# EAGLE design OV5640 (EAGLE 9.4.2)
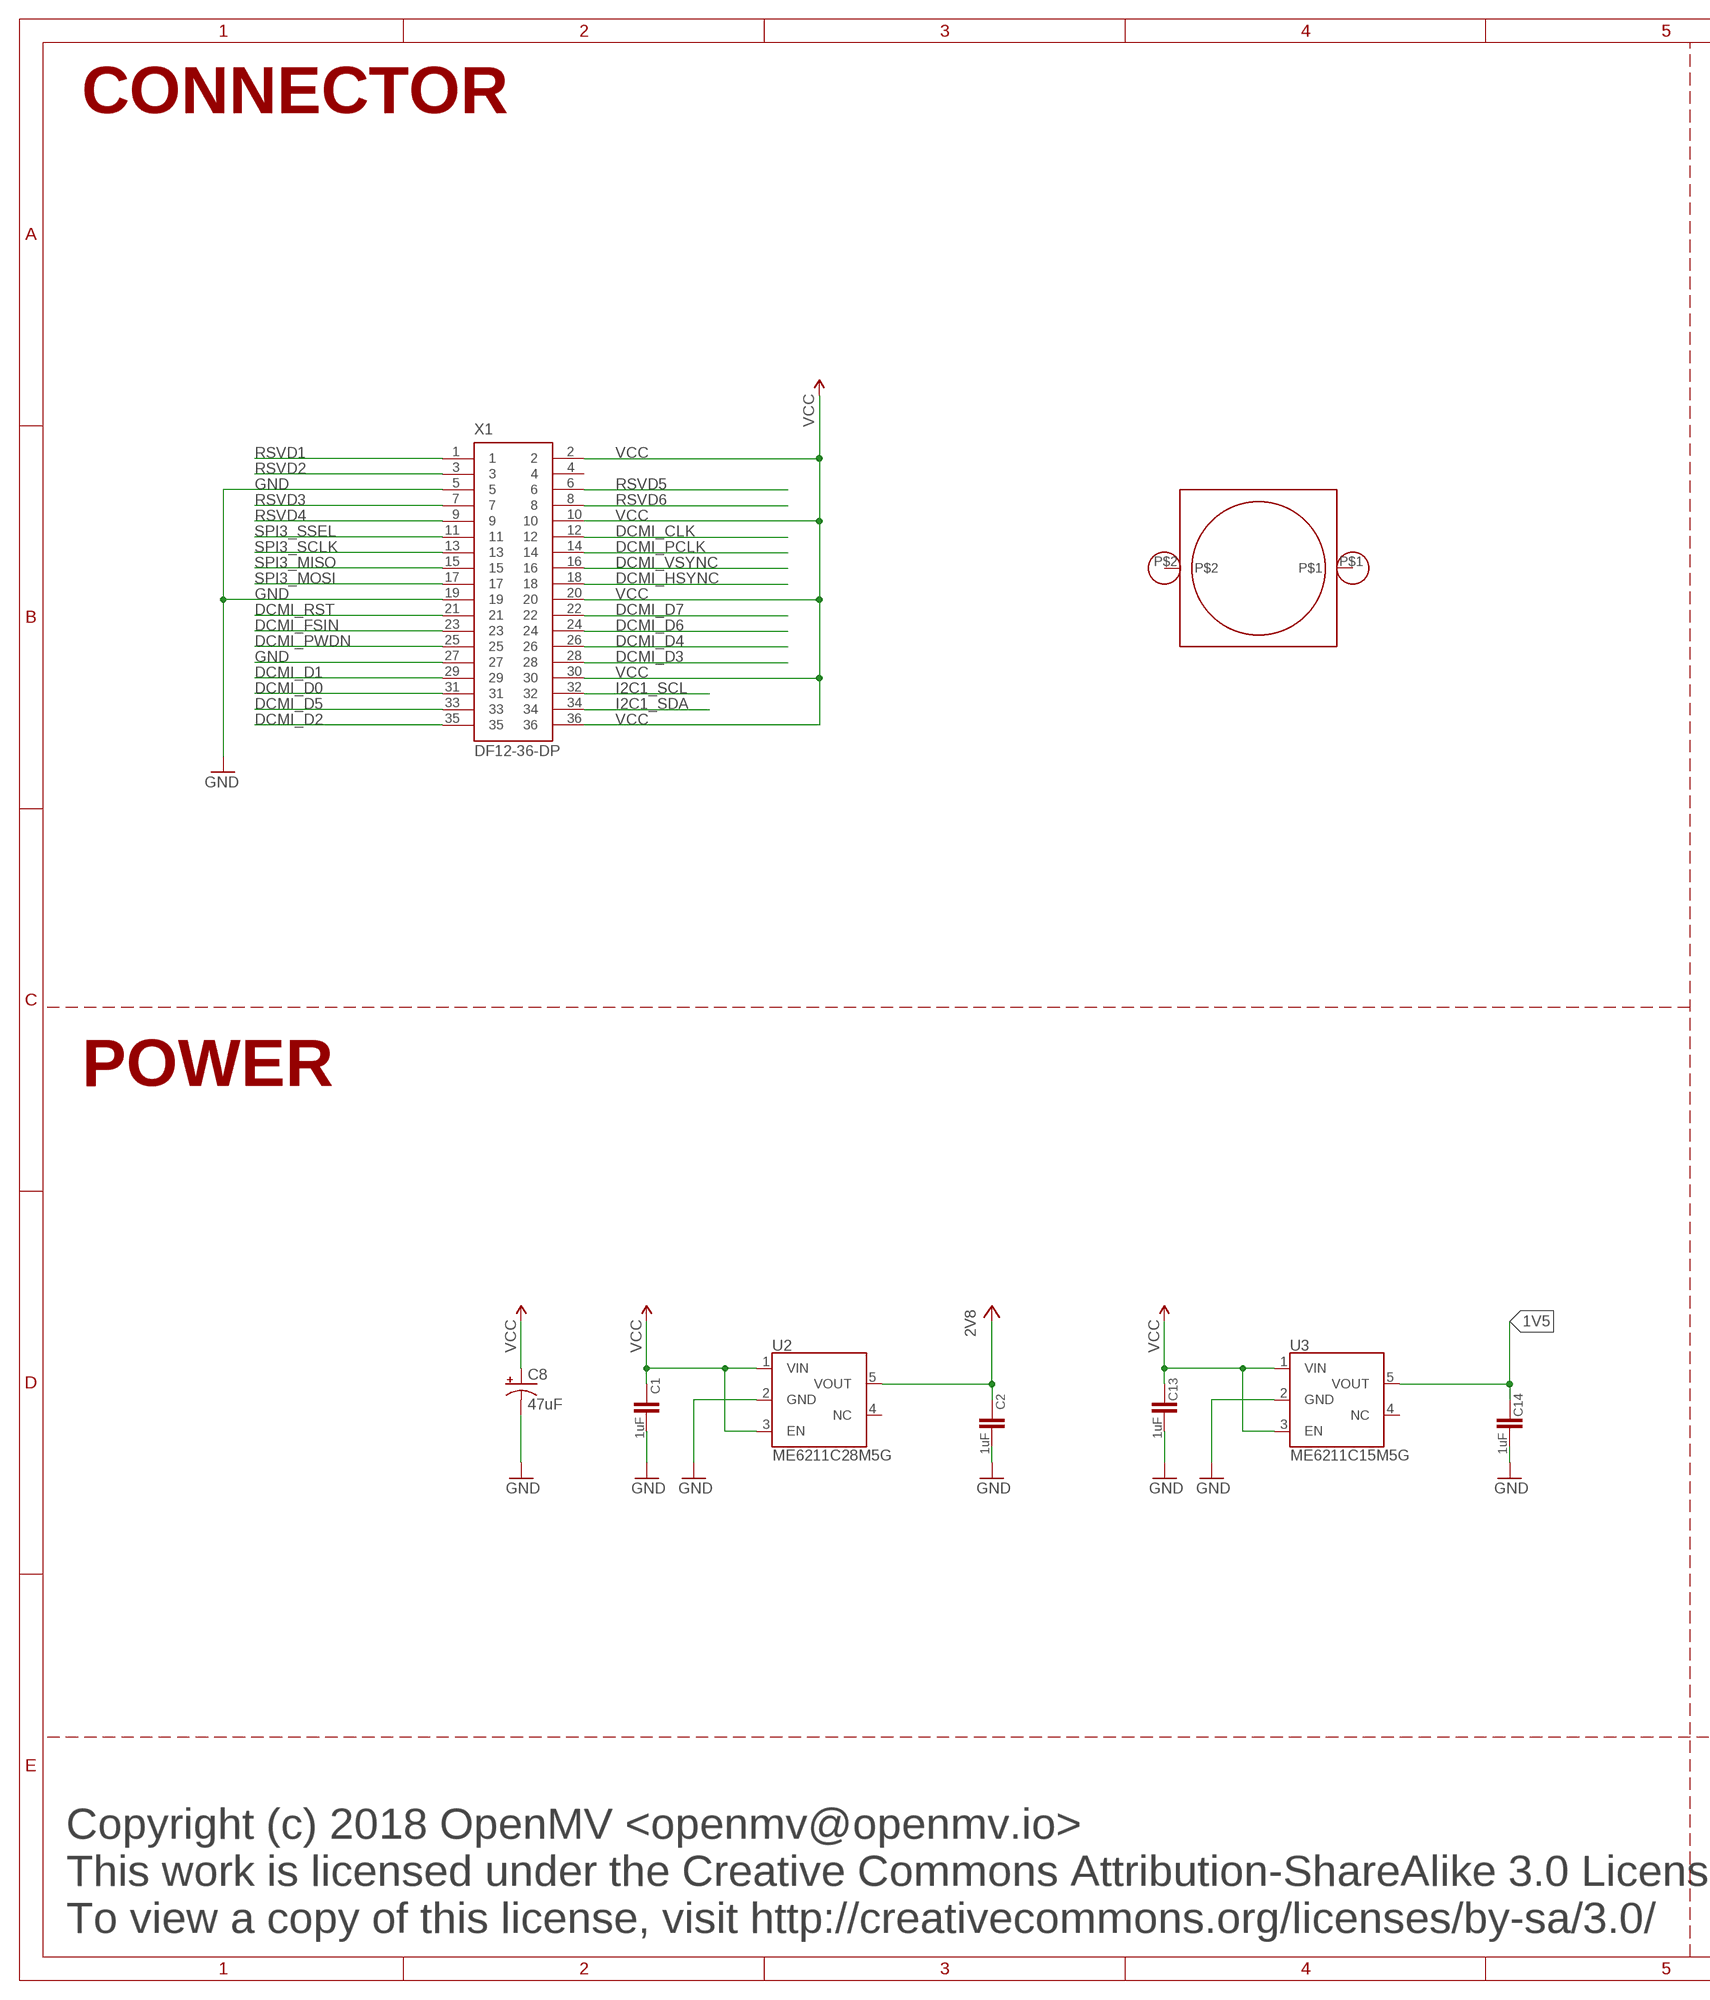
[diagram p0: schematic, sheet 1, part 1 of 2]
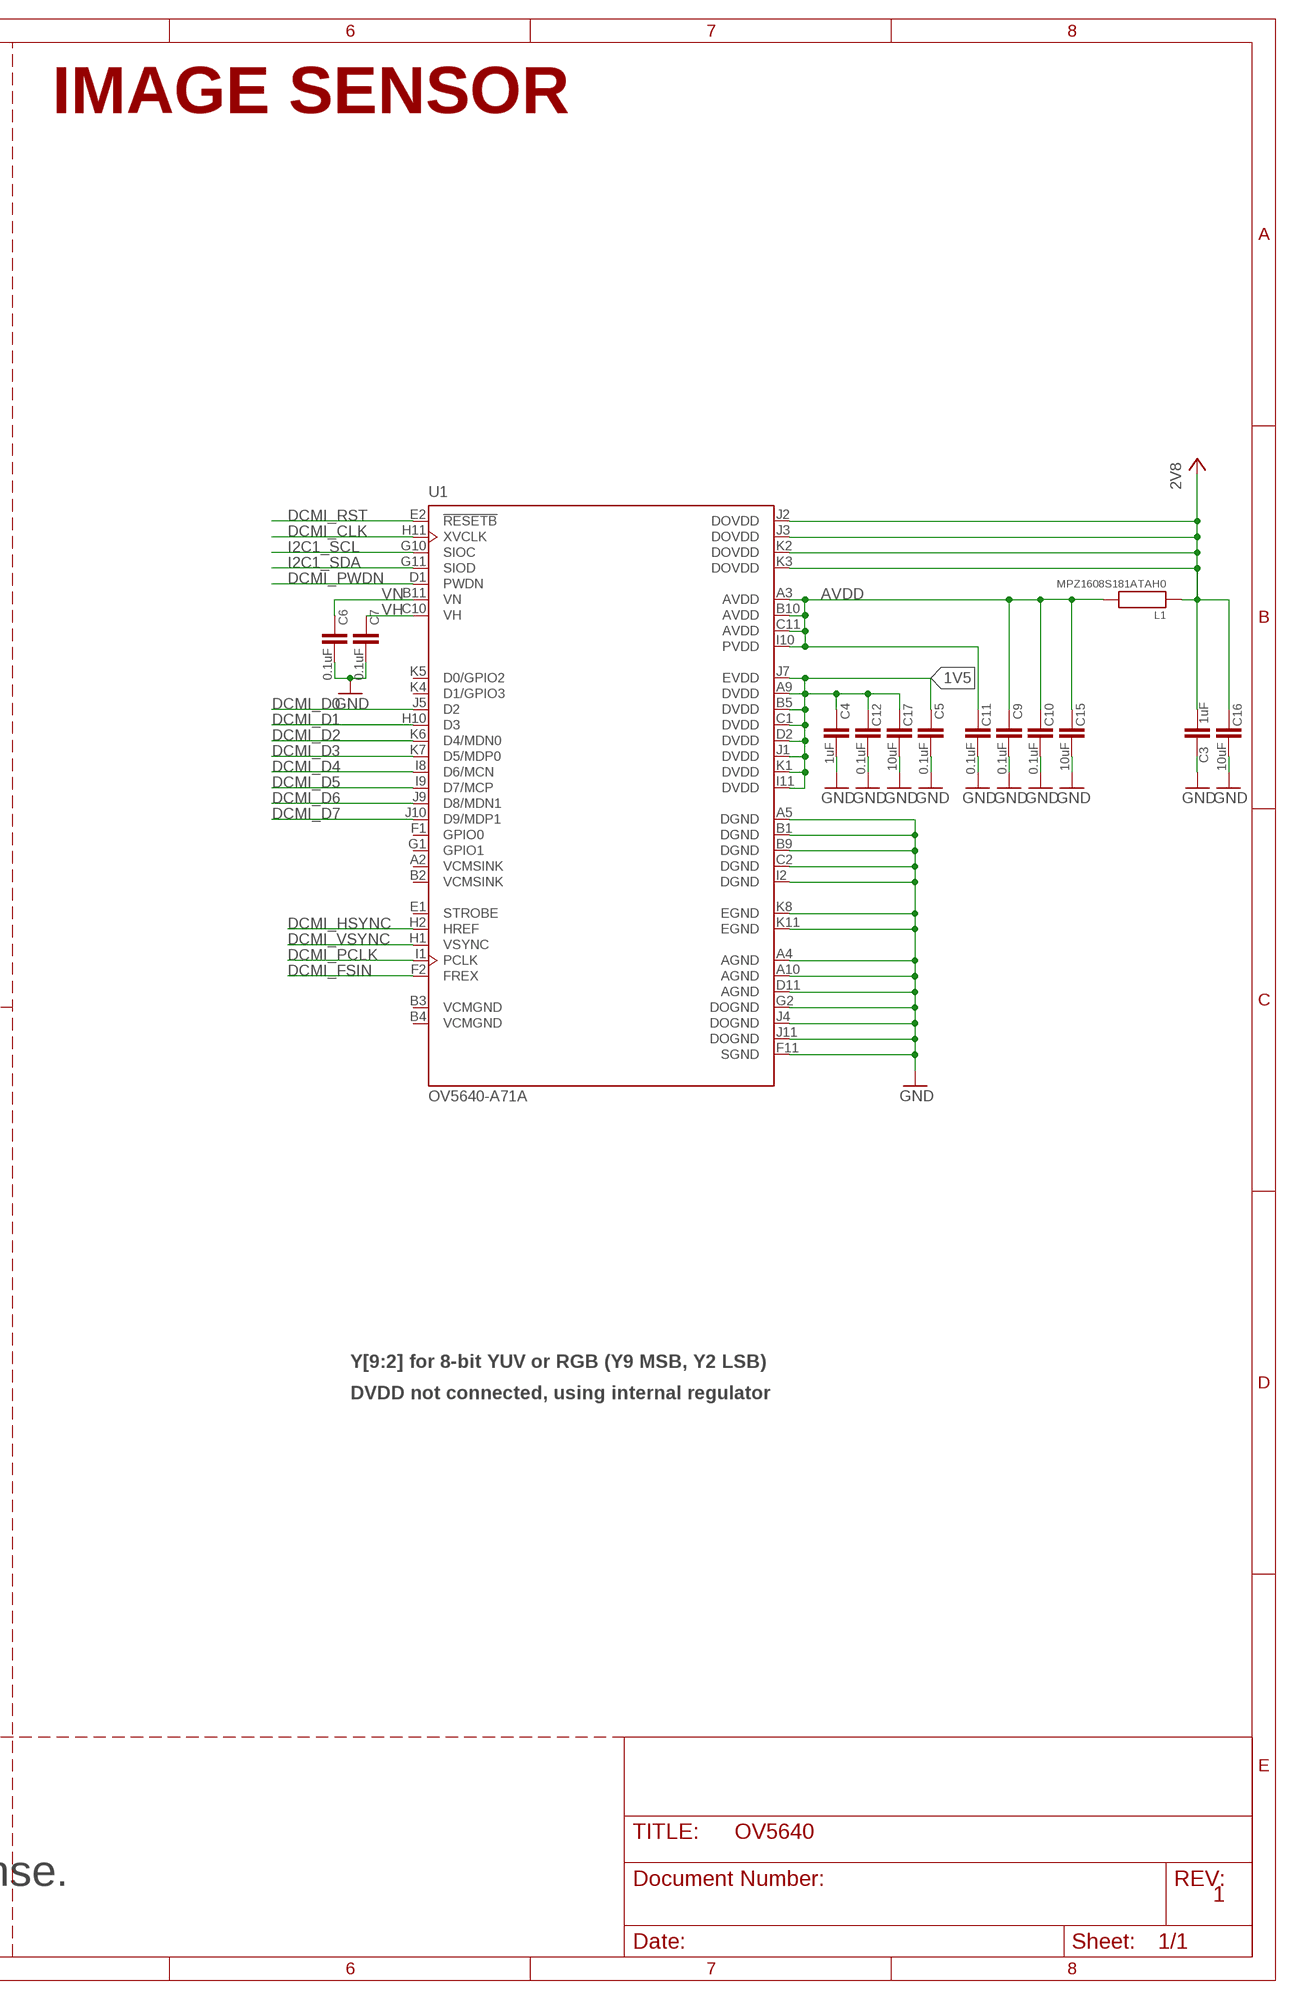
[diagram p1: schematic, sheet 1, part 2 of 2]

## Parts
C1  1uF  CAP0402-CAP  [0402-CAP]
C2  1uF  CAP0402-CAP  [0402-CAP]
C3  1uF  CAP0402-CAP  [0402-CAP]
C4  1uF  CAP0402-CAP  [0402-CAP]
C5  0.1uF  CAP0402-CAP  [0402-CAP]
C6  0.1uF  CAP0402-CAP  [0402-CAP]
C7  0.1uF  CAP0402-CAP  [0402-CAP]
C8  47uF  CAP_POL1206  [EIA3216]
C9  0.1uF  CAP0402-CAP  [0402-CAP]
C10  0.1uF  CAP0402-CAP  [0402-CAP]
C11  0.1uF  CAP0402-CAP  [0402-CAP]
C12  0.1uF  CAP0402-CAP  [0402-CAP]
C13  1uF  CAP0402-CAP  [0402-CAP]
C14  1uF  CAP0402-CAP  [0402-CAP]
C15  10uF  CAP0402-CAP  [0402-CAP]
C16  10uF  CAP0402-CAP  [0402-CAP]
C17  10uF  CAP0402-CAP  [0402-CAP]
L1  MPZ1608S181ATAH0  BEAD  [0402-CAP]
LM1  LENSMOUNT20MM  [LENSMOUNT-20MM]
U1  OV5640-A71A  [BGA71C50P11X11_598X584X81]
U2  ME6211C28M5G  ADP150TSOT-5  [SOT23-5]
U3  ME6211C15M5G  ADP150TSOT-5  [SOT23-5]
X1  DF12-36-DP  [DF12-36-DP]

## Nets
1V5: C4.2 C5.2 C12.2 C14.2 C17.2 U1.A9(DVDD) U1.B5(DVDD) U1.C1(DVDD) U1.D2(DVDD) U1.I11(DVDD) U1.J1(DVDD) U1.J7(EVDD) U1.K1(DVDD) U3.5(VOUT)
2V8: C2.2 C3.1 C16.2 L1.1 U1.J2(DOVDD) U1.J3(DOVDD) U1.K2(DOVDD) U1.K3(DOVDD) U2.5(VOUT)
AVDD: C9.2 C10.2 C11.2 C15.2 L1.2 U1.A3(AVDD) U1.B10(AVDD) U1.C11(AVDD) U1.I10(PVDD)
DCMI_CLK: U1.H11(XVCLK) X1.12
DCMI_D0: U1.J5(D2) X1.31
DCMI_D1: U1.H10(D3) X1.29
DCMI_D2: U1.K6(D4/MDN0) X1.35
DCMI_D3: U1.K7(D5/MDP0) X1.28
DCMI_D4: U1.I8(D6/MCN) X1.26
DCMI_D5: U1.I9(D7/MCP) X1.33
DCMI_D6: U1.J9(D8/MDN1) X1.24
DCMI_D7: U1.J10(D9/MDP1) X1.22
DCMI_FSIN: U1.F2(FREX) X1.23
DCMI_HSYNC: U1.H2(HREF) X1.18
DCMI_PCLK: U1.I1(PCLK) X1.14
DCMI_PWDN: U1.D1(PWDN) X1.25
DCMI_RST: U1.E2(!RESETB) X1.21
DCMI_VSYNC: U1.H1(VSYNC) X1.16
GND: C1.1 C2.1 C3.2 C4.1 C5.1 C6.1 C7.1 C8.C(-) C9.1 C10.1 C11.1 C12.1 C13.1 C14.1 C15.1 C16.1 C17.1 U1.A4(AGND) U1.A5(DGND) U1.A10(AGND) U1.B1(DGND) U1.B9(DGND) U1.C2(DGND) U1.D11(AGND) U1.F11(SGND) U1.G2(DOGND) U1.I2(DGND) U1.J4(DOGND) U1.J11(DOGND) U1.K8(EGND) U1.K11(EGND) U2.2(GND) U3.2(GND) X1.5 X1.19 X1.27
I2C1_SCL: U1.G10(SIOC) X1.32
I2C1_SDA: U1.G11(SIOD) X1.34
RSVD1: X1.1
RSVD2: X1.3
RSVD3: X1.7
RSVD4: X1.9
RSVD5: X1.6
RSVD6: X1.8
SPI3_MISO: X1.15
SPI3_MOSI: X1.17
SPI3_SCLK: X1.13
SPI3_SSEL: X1.11
VCC: C1.2 C8.A(+) C13.2 U2.1(VIN) U2.3(EN) U3.1(VIN) U3.3(EN) X1.2 X1.10 X1.20 X1.30 X1.36
VH: C7.2 U1.C10(VH)
VN: C6.2 U1.B11(VN)
Unconnected: LM1.P$1 LM1.P$2 U1.A2(VCMSINK) U1.B2(VCMSINK) U1.B3(VCMGND) U1.B4(VCMGND) U1.E1(STROBE) U1.F1(GPIO0) U1.G1(GPIO1) U1.K4(D1/GPIO3) U1.K5(D0/GPIO2) U2.4(NC) U3.4(NC) X1.4

## Notes on the sheet
- CONNECTOR | IMAGE SENSOR
- POWER
- Y[9:2] for 8-bit YUV or RGB (Y9 MSB, Y2 LSB)
- DVDD not connected, using internal regulator
- Copyright (c) 2018 OpenMV <openmv@openmv.io>
- This work is licensed under the Creative Commons Attribution-ShareAlike 3.0 License.
- 1
- To view a copy of this license, visit http://creativecommons.org/licenses/by-sa/3.0/

## Library data of the parts
C1-C7 C9-C17 = sfe:CAP: Capacitor Standard 0603 ceramic capacitor, and 0.1" leaded capacitor.
C8 = sfe:CAP_POL: Capacitor Polarized These are standard SMD and PTH capacitors. Normally 10uF, 47uF, and 100uF in electrolytic and tantalum varieties. Always verify the external diameter of the through hole cap, it varies with capacity, voltage, and manufacturer. The EIA devices should be standard.
L1 = heka:BEAD
LM1 = omnivision:LENSMOUNT
U1 = OV5640-A71A:OV5640-A71A: 1/4" color CMOS QSXGA (5 megapixel) image sensor with OmniBSI™ technology; AVAILABILITY: Unavailable; MF: Omron; MP: OV5640-A71A; PACKAGE: None; PRICE: None
U2 U3 = leptonCustom:ADP150: ADP150 2.8V 150mA Linear LDO Regulator Analog Devices ADP150AUJZ-2.8-R7
X1 = DF12:DF12-36-DP

## Board
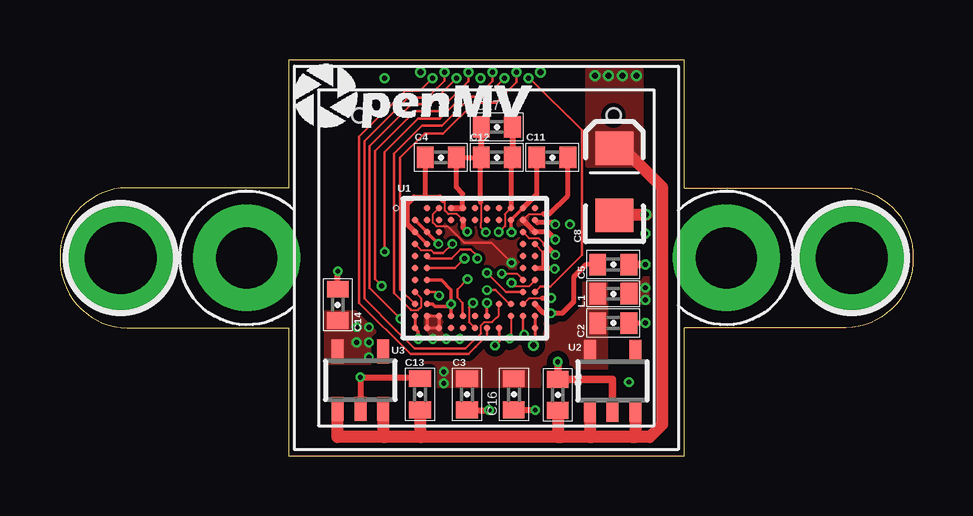
[diagram p2: board, top side]
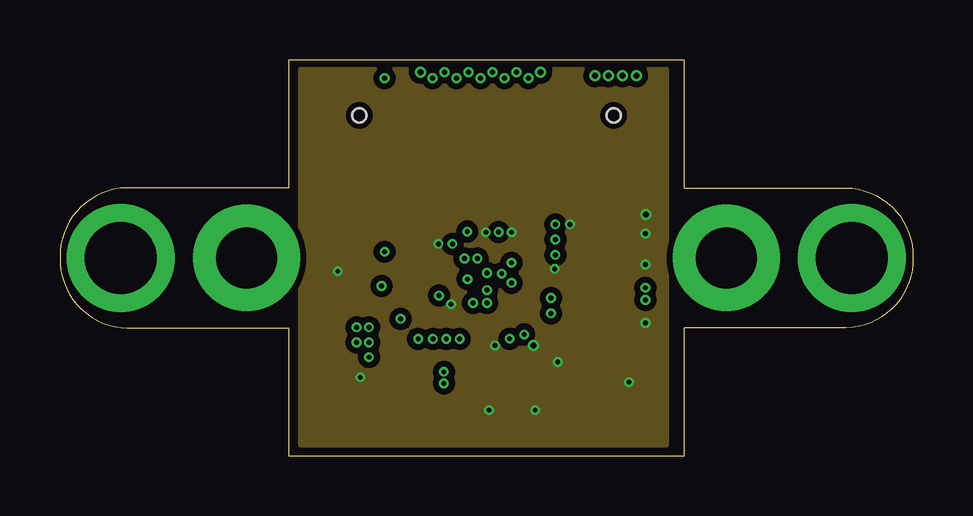
[diagram p3: board, inner layer GND]
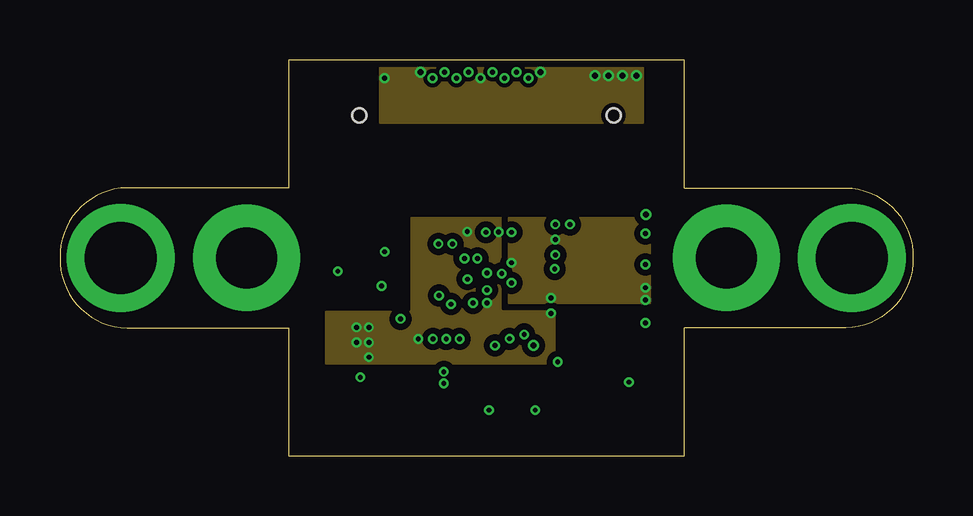
[diagram p4: board, inner layer VCC]
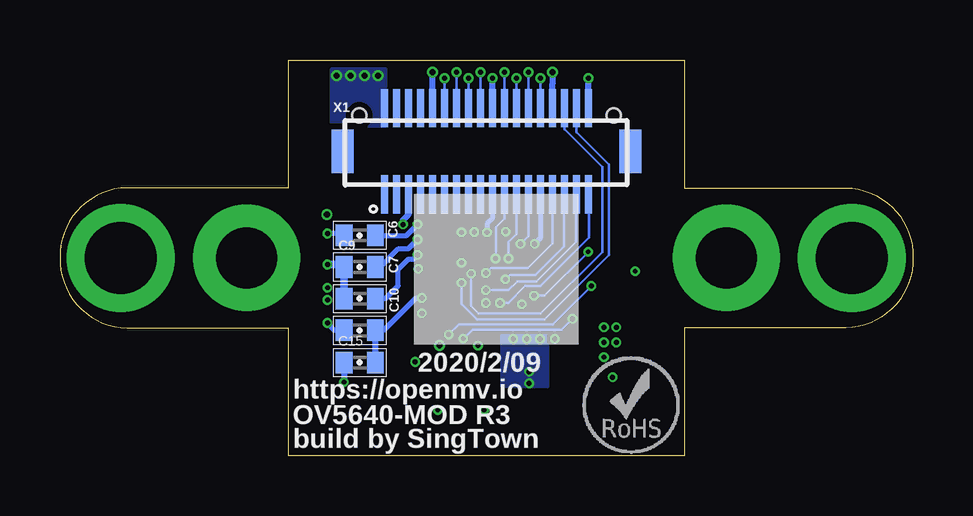
[diagram p5: board, bottom side, seen from below]

Size 35.56 x 16.51 mm. Coordinates in mm from the lower left corner, seen from the top.
Outline: 9.53,16.51 9.53,11.18 2.79,11.18 arc90 0,8.26 arc90 2.79,5.33 9.53,5.33 9.53,0 26.04,0 26.04,5.33 32.77,5.33 arc90 35.56,8.26 arc90 32.77,11.18 26.04,11.18 26.04,16.51 9.53,16.51
Copper layers (1*2+15*16): Top 0.035mm / dielectric 1.5mm / GND 0.035mm / dielectric 0.15mm / VCC 0.035mm / dielectric 0.2mm / Bottom 0.035mm
Design rules "default *": minimum track width 3mil, minimum drill 8mil, track to track 3mil, track to pad 3mil, pad to pad 5mil, via to via 5mil, smd to smd 5mil, copper to edge 8mil, drill to drill 10mil, minimum pad ring 10mil, minimum via ring 4mil, stop-mask expansion 2mil, vias tented up to drill 30mil, thermal gap 10mil

### Footprints (pad centres in the part's own frame; a part is rotated, then mirrored left to right if it is on the bottom)
0402-CAP = smd 0.7 x 0.9: 1 -0.65,0; 2 0.65,0
EIA3216 = smd 1.4 x 1.6: A 1.4,0; C -1.4,0
LENSMOUNT-20MM = drill 2.54 pad 4.445: P$1 -10,0; P$2 10,0
BGA71C50P11X11_598X584X81 = smd 0.27 x 0.27: A2 -2,2.5; A3 -1.5,2.5; A4 -1,2.5; A5 -0.5,2.5; A6 0,2.5; A7 0.5,2.5; A8 1,2.5; A9 1.5,2.5; A10 2,2.5; A11 2.5,2.5; B1 -2.5,2; B2 -2,2; B3 -1.5,2; B4 -1,2; B5 -0.5,2; B6 0,2; B7 0.5,2; B8 1,2; B9 1.5,2; B10 2,2; B11 2.5,2; C1 -2.5,1.5; C2 -2,1.5; C3 -1.5,1.5; C10 2,1.5; C11 2.5,1.5; D1 -2.5,1; D2 -2,1; D10 2,1; D11 2.5,1; E1 -2.5,0.5; E2 -2,0.5; E10 2,0.5; E11 2.5,0.5; F1 -2.5,0; F2 -2,0; F10 2,0; F11 2.5,0; G1 -2.5,-0.5; G2 -2,-0.5; G10 2,-0.5; G11 2.5,-0.5; H1 -2.5,-1; H2 -2,-1; H10 2,-1; H11 2.5,-1; I1 -2.5,-1.5; I2 -2,-1.5; I8 1,-1.5; I9 1.5,-1.5; I10 2,-1.5; I11 2.5,-1.5; J1 -2.5,-2; J2 -2,-2; J3 -1.5,-2; J4 -1,-2; J5 -0.5,-2; J6 0,-2; J7 0.5,-2; J9 1.5,-2; J10 2,-2; J11 2.5,-2; K1 -2.5,-2.5; K2 -2,-2.5; K3 -1.5,-2.5; K4 -1,-2.5; K5 -0.5,-2.5; K6 0,-2.5; K7 0.5,-2.5; K8 1,-2.5; K11 2.5,-2.5
SOT23-5 = smd 0.5 x 1: 1 -0.95,-1.2; 2 0,-1.2; 3 0.95,-1.2; 4 0.95,1.2; 5 -0.95,1.2
DF12-36-DP = smd 0.3 x 1.6: 1 -4.25,-1.8; 2 -4.25,1.8; 3 -3.75,-1.8; 4 -3.75,1.8; 5 -3.25,-1.8; 6 -3.25,1.8; 7 -2.75,-1.8; 8 -2.75,1.8; 9 -2.25,-1.8; 10 -2.25,1.8; 11 -1.75,-1.8; 12 -1.75,1.8; 13 -1.25,-1.8; 14 -1.25,1.8; 15 -0.75,-1.8; 16 -0.75,1.8; 17 -0.25,-1.8; 18 -0.25,1.8; 19 0.25,-1.8; 20 0.25,1.8; 21 0.75,-1.8; 22 0.75,1.8; 23 1.25,-1.8; 24 1.25,1.8; 25 1.75,-1.8; 26 1.75,1.8; 27 2.25,-1.8; 28 2.25,1.8; 29 2.75,-1.8; 30 2.75,1.8; 31 3.25,-1.8; 32 3.25,1.8; 33 3.75,-1.8; 34 3.75,1.8; 35 4.25,-1.8; 36 4.25,1.8 | smd 0.9 x 1.8: F1 -6,0; F2 6,0 | hole 0.6: -5.3,1.5; 5.3,1.5

### Placement (x,y rotation side)
C1  20.75,2.54 270 top
C2  23.06,5.54 180 top
C3  16.97,2.57 270 top
C4  15.88,12.45 180 top
C5  23.06,7.98 180 top
C6  23.06,9.19 0 bottom
C7  23.06,6.55 0 bottom
C8  23.11,11.43 90 top
C9  23.06,7.87 0 bottom
C10  23.06,5.23 0 bottom
C11  20.52,12.45 0 top
C12  18.21,12.45 0 top
C13  15.01,2.57 270 top
C14  11.58,6.3 270 top
C15  23.06,3.89 0 bottom
C16  18.92,2.57 90 top
C17  18.21,13.72 0 top
L1  23.06,6.76 0 top
LM1  17.78,8.26 0 top
U1  17.3,7.83 0 top
U2  23.04,3.12 0 top
U3  12.52,3.15 0 top
U$2  [ROHS]  13.77,0.1 0 bottom
U$6  [OMV-LOGO-SMALL]  9.65,13.51 0 top
X1  17.78,12.7 0 bottom

### Tracks (layer width: path | path; a pad name or v marks a point on that pad's centre or on a via)
1V5  (via drill 0.2)
  Top 0.076: U1.B5 16.54,10.08 16.2,10.08 16.05,10.22 16.05,10.57 15.98,10.64 | U1.A9 18.55,10.07 18.55,9.59
  Top 0.102: 18.55,9.59 v18.29,9.33
  Top 0.127: U1.J1 U1.K1 | U1.J7 17.8,6.1 v17.8,6.37 v17.8,6.38
  Top 0.152: U1.D2 U1.C1 | v14.94,4.88 14.94,5.19 U1.K1
  Top 0.203: C5.2 21.93,7.98 21.41,7.46 21.41,6.43 20.93,5.94 v20.47,5.94 20.18,5.94 U1.I11 | U1.C1 14.49,9.64 14.49,10.53 14.76,10.79 15.19,10.79 15.23,10.79 | 15.23,10.79 15.82,10.79 15.98,10.64 | C4.2 15.23,10.79 | U1.B5 16.8,9.53 v16.98,9.35 | U1.A9 18.81,10.34 18.81,12.39 C12.2
  Top 0.254: U1.C1 | C17.2 C12.2
  other vias: 12.88,4.11 12.88,4.72 12.88,5.36 12.37,5.36 12.37,4.72
  pour VCC (isolate 0.254, rank 2): 11.1,3.86 11.1,5.99 14.66,5.99 14.66,9.91 20.62,9.91 20.62,3.86
  pour Top (isolate 0.254, rank 2, no thermals): 11.07,3.86 11.07,5.99 13.11,5.99 13.11,3.86
2V8  (via drill 0.2)
  Top 0.127: U1.J2 U1.J3 U1.K3 U1.K2 U1.J2
  other vias: 15.54,4.88 16.1,4.88 16.66,4.88 16,3.02 16,3.51
  pour Top (isolate 0.254, no thermals): 15.21,7.21 15.21,2.87 22.81,2.87 22.81,7.21
  pour Bottom (isolate 0.127, no thermals): 15.21,5.92 15.21,2.87 17.14,2.87 17.14,5.92
AVDD  (via drill 0.2)
  Top 0.076: U1.I10 19.32,6.33 19.57,6.57 20.1,6.57 | U1.B10 19.55,10.08 20.13,10.08 20.14,10.08 | U1.A3 15.55,10.07 15.55,9.72 15.7,9.58 16.16,9.58 16.84,8.89 17.98,8.89 v18.82,8.05
  Top 0.203: 20.1,6.57 v20.47,6.57 v20.47,6.58 | C11.2 21.17,10.86 20.39,10.08 20.14,10.08 | v20.65,9.02 20.34,9.32 U1.C11 U1.B10
  Bottom 0.203: C10.2 22.07,5.23 20.73,6.58 v20.47,6.58 | C9.2 22.2,7.87 21.44,8.64 21.03,8.64 v20.65,9.02
  Bottom 0.254: C15.2 C10.2
  other vias: 24.41,6.5 24.41,7.01
  pour VCC (isolate 0.254, no thermals): 24.59,6.38 24.59,9.91 18.72,9.91 18.72,6.38
  pour Top (isolate 0.127, no thermals): 19.69,7.67 19.69,9.96 15.95,9.96 15.95,7.67
  pour Top (isolate 0.254, no thermals): 24.59,6.35 24.59,7.44 23.44,7.44 23.44,6.35
DCMI_CLK  (via drill 0.2)
  Top 0.102: v19.53,15.75 19.58,15.75 21.76,13.57 21.76,8.37 20.45,7.06 20.04,7.06 U1.H11
  Bottom 0.102: X1.12 v19.53,15.75
DCMI_D0  (via drill 0.2)
  Top 0.102: U1.J5 16.79,5.84 16.79,6.38 16.57,6.6 16.57,6.95 v16.99,7.37
  Bottom 0.102: X1.31 14.55,10.88 14.55,9.78 14.55,8.99 14.55,8.91 14.55,8.73 15.73,7.55 16.81,7.55 v16.99,7.37
DCMI_D1  (via drill 0.2)
  Top 0.102: v17.8,7.62 18.6,6.83 U1.H10
  Bottom 0.102: v17.8,7.62 17.6,7.83 16.04,7.83 15.02,8.85 15.02,9.73 15.02,10.89 X1.29
DCMI_D2  (via drill 0.2)
  Top 0.076: U1.K6 17.05,5.57 17.05,6.21 v17.22,6.38
  Bottom 0.102: X1.35 13.5,10.87 13.5,9.11 15.53,7.07 16.17,7.07 16.87,6.38 v17.22,6.38
DCMI_D3  (via drill 0.2)
  Top 0.102: v15.53,15.75 15.02,15.23 14.4,15.23 12.47,13.31 12.47,6.38 14.61,4.24 17.03,4.24 17.33,4.54 17.8,5.02 U1.K7
  Bottom 0.102: X1.28 v15.53,15.75
DCMI_D4  (via drill 0.2)
  Top 0.076: 17.55,5.11 17.55,5.43 17.7,5.57 18.02,5.57 18.19,5.74 18.26,5.82 18.3,5.85 U1.I8
  Top 0.102: v16.03,16 16.03,15.65 15.32,14.94 14.5,14.94 12.7,13.13 12.7,6.73 12.7,6.55 14.02,5.23 14.78,4.47 16.92,4.47 17.55,5.11
  Bottom 0.102: X1.26 v16.03,16
DCMI_D5  (via drill 0.2)
  Top 0.102: v17.8,6.91 18.16,6.91 18.75,6.33 U1.I9
  Bottom 0.102: X1.33 14.05,10.88 14.05,8.92 15.7,7.28 16.5,7.28 16.86,6.91 v17.8,6.91
DCMI_D6  (via drill 0.2)
  Top 0.089: U1.J9 18.8,4.94 v18.75,4.88
  Top 0.102: v14.2,5.71 12.91,7 12.91,12.91 14.65,14.66 15.44,14.66 v16.53,15.75
  Bottom 0.102: X1.24 v16.53,15.75 | v18.75,4.88 18.37,5.26 14.66,5.26 v14.2,5.71
DCMI_D7  (via drill 0.2)
  Top 0.102: v17.03,16 17.03,15.63 15.77,14.38 14.81,14.38 13.13,12.7 13.13,7.37 v13.41,7.09 | U1.J10 19.3,5.11 v19.36,5.05
  Bottom 0.102: X1.22 v17.03,16 | v13.41,7.09 15.01,5.49 18.92,5.49 v19.36,5.05
DCMI_FSIN  (via drill 0.2)
  Top 0.102: U1.F2 16.02,7.82 | 16.02,7.82 | v16.87,8.23 16.46,7.82 16.02,7.82
  Bottom 0.102: X1.23 16.53,10.03 16.53,9.25 16.87,8.91 v16.87,8.23
DCMI_HSYNC  (via drill 0.2)
  Top 0.102: v18.03,16 18.03,15.62 17.65,15.24 17.14,15.24 17.02,15.24 15.85,14.07 14.94,14.07 13.54,12.68 v13.54,8.51 | U1.H2 15.65,6.83 v15.8,6.68
  Bottom 0.102: X1.18 v18.03,16 | v15.8,6.68 15.37,6.68 v13.54,8.51
DCMI_PCLK  (via drill 0.2)
  Top 0.102: v19.03,16 v19.04,15.99 19.04,15.59 18.18,14.73 17.27,14.73 15.98,13.44 15.19,13.44 14.19,12.43 14.19,6.94 U1.I1
  Bottom 0.102: X1.14 v19.03,16
DCMI_PWDN  (via drill 0.2)
  Top 0.076: U1.D1 15.05,8.58 15.46,8.58 15.59,8.45
  Top 0.102: 15.59,8.45 15.97,8.45 v16.36,8.84
  Bottom 0.102: X1.25 16.03,9.17 v16.36,8.84
DCMI_RST  (via drill 0.2)
  Top 0.102: U1.E2 15.39,8.23 16.33,8.23 16.71,8.61 17.12,8.61 17.4,8.33 v17.4,8.23
  Bottom 0.102: X1.21 17.03,9.89 17.37,9.55 17.37,8.26 v17.4,8.23
DCMI_VSYNC  (via drill 0.2)
  Top 0.076: 14.61,6.1 14.62,6.08 14.93,6.08 15.05,6.2 15.05,6.58 U1.H1
  Top 0.102: v18.53,15.75 17.77,14.99 17.14,14.99 15.93,13.77 15.09,13.77 13.92,12.6 13.92,6.78 14.61,6.1
  Bottom 0.102: X1.16 18.53,15.74 v18.53,15.75
GND  (via drill 0.2, 0.25)
  Top 0.076: v17.76,9.32 17.55,9.53 17.55,9.72 17.55,10.57
  Top 0.089: 18.15,4.62 18.15,4.61 v18.14,4.6
  Top 0.102: 20.16,8.46 U1.D11
  Top 0.127: U1.J11 U1.K11 19.8,4.66 v19.74,4.6 | 18.15,4.62 18.3,4.77 U1.K8
  Top 0.152: U1.J4 v16.3,6.32 v16.31,6.33 | v16.31,6.33 v16.31,6.31 16.22,6.22 15.63,6.22 15.53,6.33 U1.I2 | v16.31,6.33 16.31,6.92 15.91,7.33 U1.G2 | v15.77,8.84 15.6,9.02 U1.C2 U1.B1 | v18.82,9.32 18.8,9.34 U1.B9 U1.A10
  Top 0.203: v20.62,7.8 20.6,7.83 20.19,7.83 | U1.F11 20.19,7.83 | C11.1 19.87,10.9 U1.A10 | U1.A5 16.79,10.34 16.79,10.94 16.52,11.2 C4.1 C12.1 17.51,12.39 17.51,10.61 17.55,10.57 | C2.1 v24.41,5.54 | 14.95,3.28 C13.1 | 20.16,8.46 20.16,7.85 20.19,7.83
  Top 0.254: C14.1 v11.58,7.7 | v17.88,1.91 16.98,1.91 C3.2 | 14.95,3.28 v12.52,3.28 U3.2 | U1.A4 16.78,10.32 16.79,10.34 | C16.1 19.8,1.92 v19.81,1.91 | C17.1 C12.1
  Top 0.305: v20.75,3.91 C1.1 23.04,3.19 U2.2 | C5.1 v24.41,7.98
  Top 0.508: C8.C 23.14,10.06 v24.44,10.06
  Bottom 0.203: X1.19 17.53,9.9 17.76,9.68 v17.76,9.32 | X1.27 15.53,9.08 v15.77,8.84 | C6.1 23.79,9.27 v24.41,9.27 | C10.1 24.11,5.23 v24.41,5.54
  Bottom 0.254: X1.5 21.03,10.06 21.26,9.83 v21.26,9.65 | C15.1 23.71,3.08 v23.72,3.07
  Bottom 0.305: C7.1 C9.1 23.83,7.99 23.84,7.98 v24.41,7.98
  pour GND (isolate 0.254): 10.03,0.43 10.03,16.13 25.27,16.13 25.27,0.43
I2C1_SCL  (via drill 0.2)
  Top 0.076: U1.G10 19.32,7.33 19.05,7.6 v18.42,7.6
  Bottom 0.102: X1.32 14.53,13.62 12.95,12.04 12.95,8.51 15.52,5.94 16.15,5.94 18.11,5.94 18.42,6.25 v18.42,7.6
I2C1_SDA  (via drill 0.2)
  Top 0.076: v18.82,7.21 18.96,7.08 19.57,7.08 19.8,7.3 U1.G11
  Bottom 0.102: X1.34 14.03,13.49 12.68,12.14 12.68,8.38 15.37,5.69 18.18,5.69 | 18.18,5.69 | 18.18,5.69 18.82,6.33 v18.82,7.21
N$2  (via drill 3 pad 4.5)
  other vias: 2.54,8.26
N$4  (via drill 3 pad 4.5)
  other vias: 33.02,8.26
VCC  (via drill 0.2, 0.25)
  Top 0.508: U3.1 11.57,0.79 13.56,0.79 | 23.85,0.79 24.59,0.79 25.09,1.29 25.09,11.2 23.47,12.83 C8.A | 23.85,0.79 22.17,0.79 | 22.17,0.79 20.9,0.79 | 20.9,0.79 15.09,0.79 | 15.09,0.79 13.56,0.79 | U3.3 13.47,0.79 13.56,0.79 | C13.2 15.01,0.79 15.09,0.79 | C1.2 20.75,0.79 20.9,0.79 | U2.1 22.09,0.79 22.17,0.79 | U2.3 23.99,0.79 23.85,0.79
  Bottom 0.254: X1.10 20.03,15.97 v20.03,16 | X1.20 v17.53,15.75 | X1.30 15.03,15.49 15.03,15.96 v15.03,16 | X1.36 13.53,15.56 v13.53,15.75
  other vias: 23.44,15.85 24.03,15.85 22.86,15.85 22.3,15.85
  pour Bottom (isolate 0.254, rank 2, no thermals): 21.97,16.13 24.26,16.13 24.26,13.74 21.97,13.74
  pour Top (no thermals): 21.97,16.13 24.26,16.13 24.26,12.06 21.97,12.06
  pour VCC (isolate 0.178, no thermals): 13.34,13.89 24.31,13.89 24.31,16.16 13.34,16.16
VH  (via drill 0.2)
  Top 0.076: U1.C10 19.55,9.08 19.96,9.08 20.22,8.81
  Top 0.203: v20.65,8.38 20.22,8.81
  Bottom 0.203: C7.2 22,6.55 21.46,7.09 21.46,7.77 21.03,8.2 20.83,8.2 v20.65,8.38
VN  (via drill 0.2)
  Top 0.203: v20.65,9.65 20.57,9.73 19.9,9.73 U1.B11
  Bottom 0.203: C6.2 21.11,9.2 v20.65,9.65

### Text on the board
bPlace: 2020/2/09 | https://openmv.io | OV5640-MOD R3 | build by SingTown